# EasyEDA Pro project projet666.eprj, board PCB1
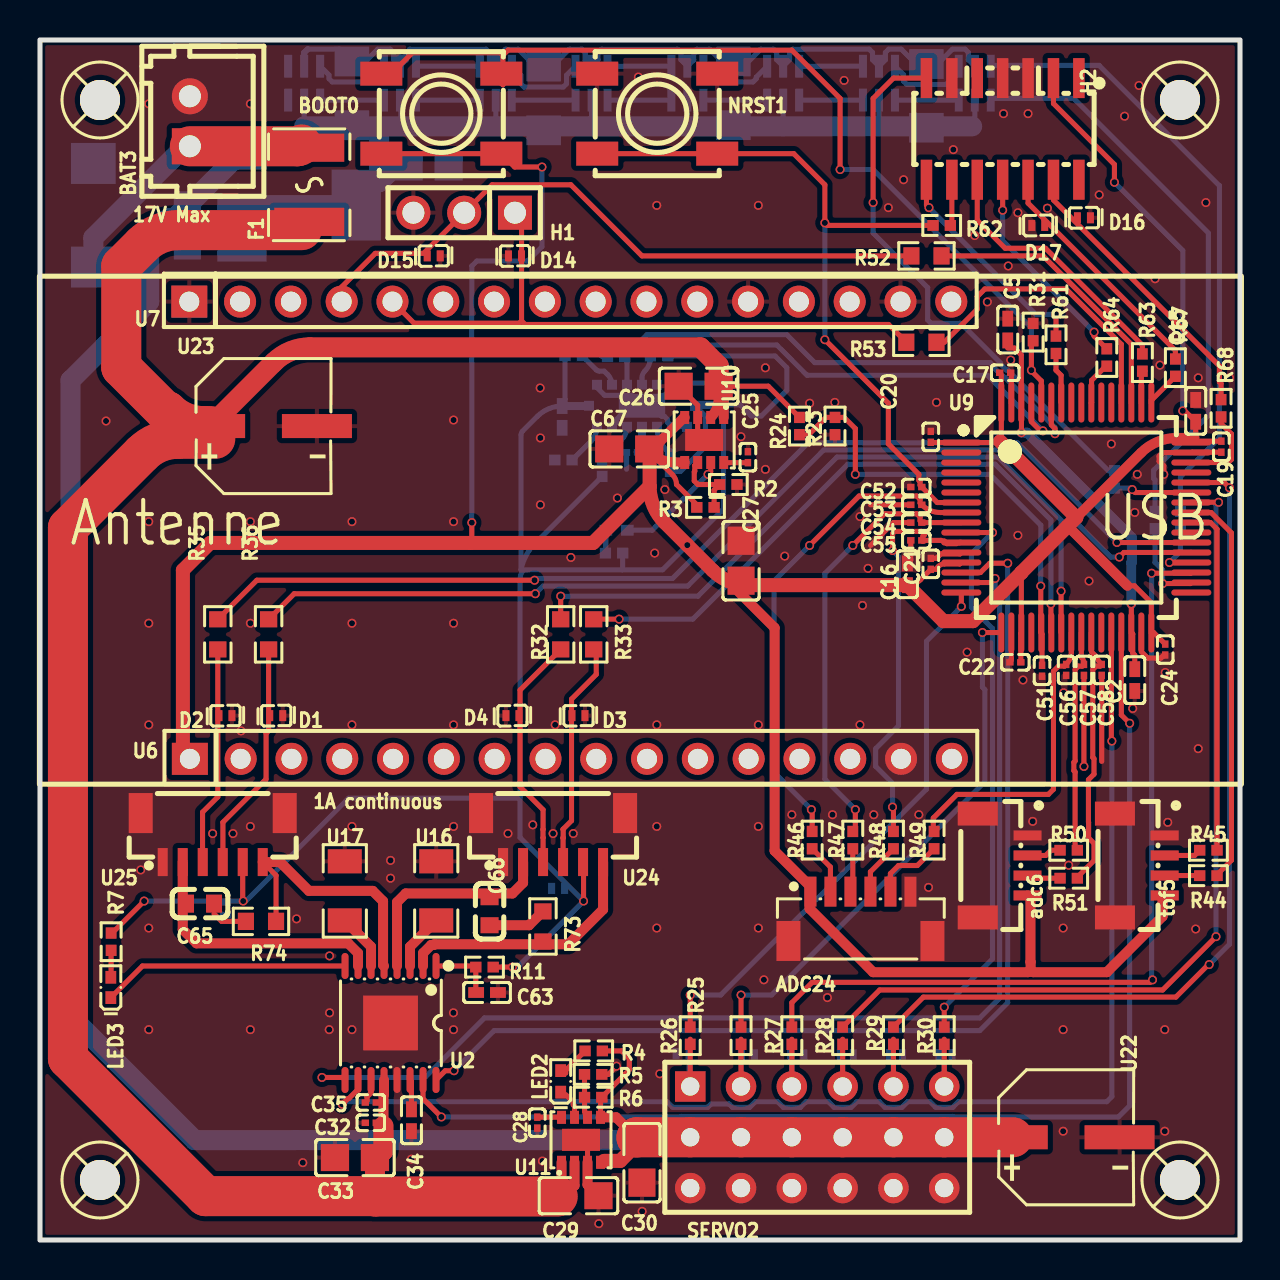
[diagram p9: board, top side]
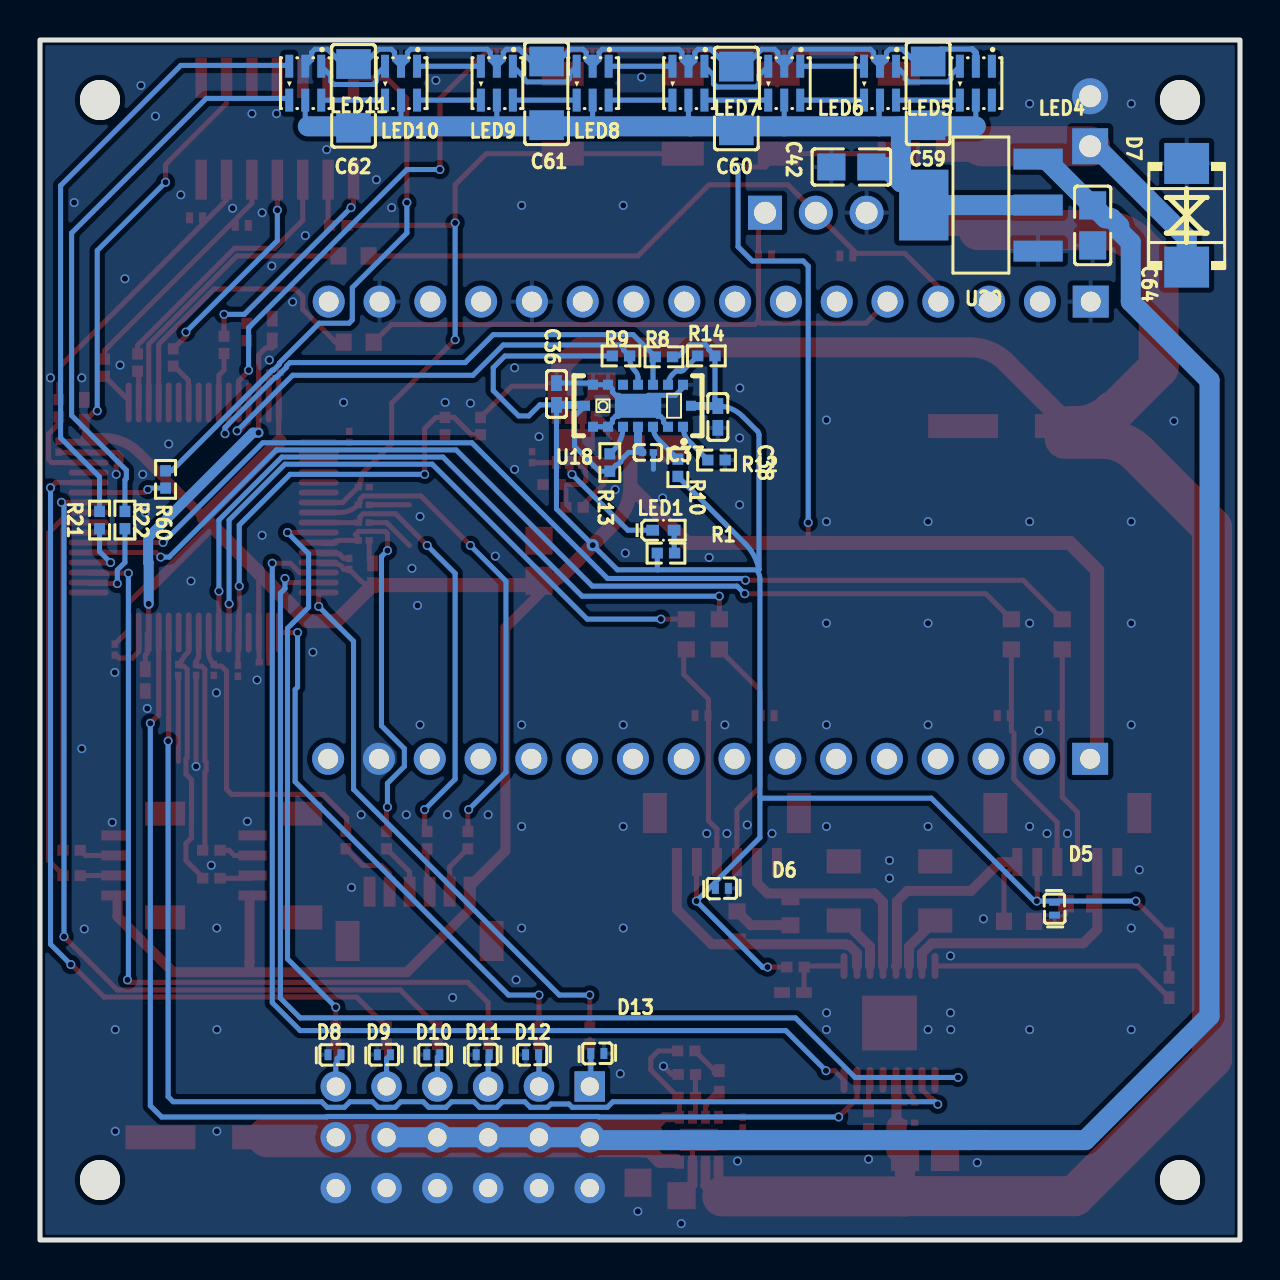
[diagram p10: board, bottom side, seen from below]

Outline 60 x 60 mm; copper layers: Top Layer, Bottom Layer. Coordinates in mm from the lower left corner of the outline.
Outline path: rectangle 0,60 60,0
Stack: Top Layer 0.035mm / Dielectric1 1.51mm FR4 er 4.5 / Bottom Layer 0.035mm

## Design rules (mm)
template: Custom Config
spacing copperThickness1oz (default): track to track 0.102, other pairs 0.152 to 0.3
spacing copperThickness2oz: track to track 0.203, other pairs 0.152 to 0.3
track width copperThickness1oz (default): min 0.127, default 0.254, max 2.54
track width copperThickness2oz: min 0.203, default 0.254, max 2.54
differential pair differentialPair (default): width min 0.127, default 0.254, max 2.54; gap min 0.152, default 0.152
via viaSize (default): diameter min 0.4, default 0.45, max 10; hole min 0.3, default 0.305, max 6.3

## Placement (name value [footprint] x y rotation side)
adc6  WAFER-SH1.0-4PLB  [CONN-SMD_4P-P1.00-C3029334]  48.13 18.72 270 top
ADC24  WAFER-SH1.0-6PLB  [CONN-SMD_6P-P1.00_1734595-6]  41.02 16.19 0 top
BAT3  ZX-XH2.54-2PZZ  [CONN-TH_2P-P2.50_HX25003-2A]  7.49 55.94 90 top
BOOT0  GT-TC063B-H035-L10  [SW-SMD_4P-L6.2-W6.2-P4.00-LS7.0]  20.07 56.32 180 top
C2  2.2uF  [C0402]  54.74 28 270 top
C5  2.2uF  [C0402]  48.39 45.52 90 top
C15  4.7uF  [C0402]  57.78 41.46 270 top
C16  1uF  [C0402]  43.37 33.29 270 top
C17  100nF  [C0201]  48.26 43.36 180 top
C19  100nF  [C0201]  59.07 39.67 90 top
C20  100nF  [C0201]  44.54 40.16 270 top
C21  100nF  [C0201]  44.54 33.81 270 top
C22  100nF  [C0201]  48.77 28.89 0 top
C24  100nF  [C0201]  56.26 29.52 90 top
C25  470pF  [C0201]  35.4 39.14 270 top
C26  22uF  [C0805]  32.93 42.69 0 top
C27  22uF  [C0805]  35.05 33.97 270 top
C28  470pF  [C0201]  24.87 5.87 90 top
C29  22uF  [C0805]  26.92 2.22 180 top
C30  22uF  [C0805]  30.1 3.87 90 top
C32  100nF  [C0201]  16.54 5.86 0 top
C33  10uF  [C0805]  15.75 4.12 0 top
C34  2.2uF  [C0402]  18.57 5.99 90 top
C35  10nF  [C0201]  16.54 6.88 180 top
C36  4.7uF  [C0402]  34.18 42.3 270 bottom
C37  100nF  [C0201]  29.6 39.38 0 bottom
C38  4.7uF  [C0402]  26.11 41.15 90 bottom
C42  22uF  [C0805]  19.43 53.65 180 bottom
C51  100nF  [C0201]  50.1 28.46 90 top
C52  100nF  [C0201]  43.81 37.65 0 top
C53  100nF  [C0201]  43.81 36.76 0 top
C54  100nF  [C0201]  43.81 35.87 0 top
C55  100nF  [C0201]  43.81 34.98 0 top
C56  100nF  [C0201]  51.31 28.5 90 top
C57  100nF  [C0201]  52.2 28.5 90 top
C58  100nF  [C0201]  53.09 28.5 90 top
C59  330nF  [C1206]  15.59 57.33 270 bottom
C60  330nF  [C1206]  25.18 57.08 270 bottom
C61  330nF  [C1206]  34.67 57.33 270 bottom
C62  330nF  [C1206]  44.32 57.21 270 bottom
C63  1uF  [C0402]  22.35 12.38 180 top
C64  22uF  [C0805]  7.37 50.73 90 bottom
C65  22nF  [C0603]  8 16.82 180 top
C66  22nF  [C0603]  22.48 16.44 90 top
C67  22uF  [C0805]  29.46 39.55 0 top
D1  RCLAMP0521P-N  [X1-DFN1006-2_L1.0-W0.6-P0.65-BI]  11.81 26.22 180 top
D2  RCLAMP0521P-N  [X1-DFN1006-2_L1.0-W0.6-P0.65-BI]  9.27 26.22 180 top
D3  RCLAMP0521P-N  [X1-DFN1006-2_L1.0-W0.6-P0.65-BI]  26.92 26.22 180 top
D4  RCLAMP0521P-N  [X1-DFN1006-2_L1.0-W0.6-P0.65-BI]  23.62 26.22 0 top
D5  RCLAMP0521P-N  [X1-DFN1006-2_L1.0-W0.6-P0.65-BI]  9.27 16.57 90 bottom
D6  RCLAMP0521P-N  [X1-DFN1006-2_L1.0-W0.6-P0.65-BI]  25.91 17.58 0 bottom
D7  SMBJ12CA  [SMB_L4.4-W3.6-LS5.3-BI]  2.67 51.24 270 bottom
D8  RCLAMP0521P-N  [X1-DFN1006-2_L1.0-W0.6-P0.65-BI]  45.27 9.26 180 bottom
D9  RCLAMP0521P-N  [X1-DFN1006-2_L1.0-W0.6-P0.65-BI]  42.81 9.26 180 bottom
D10  RCLAMP0521P-N  [X1-DFN1006-2_L1.0-W0.6-P0.65-BI]  40.34 9.26 180 bottom
D11  RCLAMP0521P-N  [X1-DFN1006-2_L1.0-W0.6-P0.65-BI]  37.87 9.26 180 bottom
D12  RCLAMP0521P-N  [X1-DFN1006-2_L1.0-W0.6-P0.65-BI]  35.4 9.26 180 bottom
D13  RCLAMP0521P-N  [X1-DFN1006-2_L1.0-W0.6-P0.65-BI]  32.13 9.33 0 bottom
D14  RCLAMP0521P-N  [X1-DFN1006-2_L1.0-W0.6-P0.65-BI]  23.75 49.2 0 top
D15  RCLAMP0521P-N  [X1-DFN1006-2_L1.0-W0.6-P0.65-BI]  19.69 49.2 180 top
D16  RCLAMP0521P-N  [X1-DFN1006-2_L1.0-W0.6-P0.65-BI]  52.2 51.11 180 top
D17  RCLAMP0521P-N  [X1-DFN1006-2_L1.0-W0.6-P0.65-BI]  49.91 50.73 0 top
F1  BSMD1812L-600-12V  [F1812]  13.46 52.76 90 top
H1  PZ254V-11-03P  [HDR-TH_3P-P2.54-V-M]  21.21 51.36 180 top
H2  FTSH-107-01-F-DV-K  [CONN-SMD_14P-P1.27_FTSH-107-01-F-DV-K-P-TR]  48.13 55.56 180 top
LED1  SZYY0402B  [LED0402-RD_BLUE]  28.83 35.49 180 bottom
LED2  SZYY0402B  [LED0402-RD_BLUE]  26.03 7.93 90 top
LED3  TZ-P2-0402RTIA1-0.45T  [LED0402-RD_RED]  3.54 12.63 90 top
LED4  SK9822-EC20  [LED-SMD_6P-L2.0-W2.0-P0.80-TL]  13.21 57.84 270 bottom
LED5  SK9822-EC20  [LED-SMD_6P-L2.0-W2.0-P0.80-TL]  18 57.84 270 bottom
LED6  SK9822-EC20  [LED-SMD_6P-L2.0-W2.0-P0.80-TL]  22.79 57.84 270 bottom
LED7  SK9822-EC20  [LED-SMD_6P-L2.0-W2.0-P0.80-TL]  27.58 57.84 270 bottom
LED8  SK9822-EC20  [LED-SMD_6P-L2.0-W2.0-P0.80-TL]  32.37 57.84 270 bottom
LED9  SK9822-EC20  [LED-SMD_6P-L2.0-W2.0-P0.80-TL]  37.16 57.84 270 bottom
LED10  SK9822-EC20  [LED-SMD_6P-L2.0-W2.0-P0.80-TL]  41.95 57.84 270 bottom
LED11  SK9822-EC20  [LED-SMD_6P-L2.0-W2.0-P0.80-TL]  46.74 57.84 270 bottom
NRST1  GT-TC063B-H035-L10  [SW-SMD_4P-L6.2-W6.2-P4.00-LS7.0]  30.86 56.32 180 top
R1  10kΩ  [R0402]  28.7 34.35 0 bottom
R2  100kΩ  [R0402]  34.42 37.78 180 top
R3  309kΩ  [R0402]  33.27 36.63 180 top
R4  10kΩ  [R0402]  27.69 9.45 0 top
R5  100kΩ  [R0402]  27.66 8.28 180 top
R6  649kΩ  [R0402]  27.66 7.14 0 top
R7  3.3kΩ  [R0402]  3.56 14.92 90 top
R8  2.2kΩ  [R0402]  28.81 44.16 180 bottom
R9  2.2kΩ  [R0402]  30.95 44.2 0 bottom
R10  47kΩ  [R0402]  28.11 38.61 270 bottom
R11  47kΩ  [R0402]  22.22 13.64 0 top
R12  47kΩ  [R0402]  26.18 39 0 bottom
R13  47kΩ  [R0402]  31.51 38.87 270 bottom
R14  47kΩ  [R0402]  26.68 44.21 180 bottom
R21  100Ω  [R0402]  57.02 36 90 bottom
R22  100Ω  [R0402]  55.75 36 90 bottom
R23  10kΩ  [R0402]  39.75 40.7 90 top
R24  30kΩ  [R0402]  37.97 40.7 90 top
R25  470Ω  [R0402]  32.51 10.22 270 top
R26  470Ω  [R0402]  35.05 10.22 270 top
R27  470Ω  [R0402]  37.59 10.22 270 top
R28  470Ω  [R0402]  40.13 10.22 270 top
R29  470Ω  [R0402]  42.67 10.22 270 top
R30  470Ω  [R0402]  45.21 10.22 270 top
R31  10kΩ  [R0402]  49.66 45.39 90 top
R32  220Ω  [R0603]  26.03 30.28 90 top
R33  220Ω  [R0603]  27.69 30.28 90 top
R35  220Ω  [R0603]  8.89 30.28 270 top
R36  220Ω  [R0603]  11.43 30.28 270 top
R44  22Ω  [R0402]  58.42 18.22 180 top
R45  22Ω  [R0402]  58.42 19.49 180 top
R46  15kΩ  [R0402]  38.61 20 270 top
R47  15kΩ  [R0402]  40.64 20 270 top
R48  15kΩ  [R0402]  42.67 20 270 top
R49  15kΩ  [R0402]  44.7 20 270 top
R50  15kΩ  [R0402]  51.44 19.49 180 top
R51  15kΩ  [R0402]  51.44 18.09 180 top
R52  220Ω  [R0603]  44.32 49.2 0 top
R53  220Ω  [R0603]  44.07 44.89 0 top
R60  33Ω  [R0402]  53.72 38.03 270 bottom
R61  33Ω  [R0402]  50.8 44.76 90 top
R62  33Ω  [R0402]  45.09 50.73 0 top
R63  33Ω  [R0402]  55.12 43.87 90 top
R64  33Ω  [R0402]  53.34 44.12 90 top
R67  33Ω  [R0402]  56.77 43.62 90 top
R68  33Ω  [R0402]  59.06 41.58 90 top
R73  4.7Ω  [R0603]  25.15 15.68 90 top
R74  4.7Ω  [R0603]  11.05 15.93 180 top
SCREW1  -  [Screw-Hole-M2]  3 57 0 top
SCREW2  -  [Screw-Hole-M2]  57 57 0 top
SCREW3  -  [Screw-Hole-M2]  57 3 0 top
SCREW4  -  [Screw-Hole-M2]  3 3 0 top
SERVO2  HX PZ2.54-3x6P ZZ  [CONN-TH_HX-PZ2.54-3X6P-ZZ]  38.86 5.14 0 top
tof5  WAFER-SH1.0-4PLB  [CONN-SMD_4P-P1.00-C3029334]  54.99 18.72 270 top
U2  DRV8833PWPR  [TSSOP-16_L5.0-W4.4-P0.65-LS6.4-BL-EP]  17.53 10.85 180 top
U6  PM254-1-16-Z-8.5  [HDR-TH_16P-P2.54-V-F-A]  26.54 24.06 0 top
U7  PM254-1-16-Z-8.5  [HDR-TH_16P-P2.54-V-F-A]  26.51 46.92 0 top
U9  STM32H563RIT6  [LQFP-64_L10.0-W10.0-P0.50-LS12.0-BL]  51.82 36.12 270 top
U10  TPS82130SILR  [USIP-8_L3.0-W2.8-P0.65-TL-EP]  33.21 40 270 top
U11  TPS82130SILR  [USIP-8_L3.0-W2.8-P0.65-TL-EP]  27.05 5.01 90 top
U16  130mΩ  [R1206]  19.81 17.45 270 top
U17  130mΩ  [R1206]  15.24 17.45 270 top
U18  VL53L7CXV0GC/1  [LGA-16_L6.4-W3.0_VL53L5CXV0GC-1]  30.1 41.71 180 bottom
U20  AMS1117-5.0  [SOT-223_L6.5-W3.5-P2.30-LS7.0-BR]  12.95 51.75 180 bottom
U22  330uF  [CAP-SMD_BD6.3-L6.6-W6.6-LS7.4-FD]  51.31 5.14 0 top
U23  330uF  [CAP-SMD_BD6.3-L6.6-W6.6-LS7.4-FD]  11.18 40.7 0 top
U24  ZX-SH1.0-6PLT  [CONN-SMD_6P-P1.00_ZX-SH1.0-6PLT]  25.65 20.12 180 top
U25  ZX-SH1.0-6PLT  [CONN-SMD_6P-P1.00_ZX-SH1.0-6PLT]  8.64 20.12 180 top

## Footprints (pads in the part's own frame, mm; a bottom-side part is the same pattern mirrored in y, then rotated)
C0201
  rect 0.368x0.324 smd: 1(-0.275,0) 2(0.275,0)
C0402
  rect 0.79x0.54 smd: 1(-0.545,0) 2(0.545,0)
C0603
  rect 0.8x0.9 smd: 1(-0.7,0) 2(0.7,0)
C0805
  rect 1.41x1.35 smd: 1(-1,0) 2(1,0)
C1206
  rect 1.485x1.728 smd: 1(-1.593,0) 2(1.593,0)
CAP-SMD_BD6.3-L6.6-W6.6-LS7.4-FD
  rect 3.5x1.2 smd: 1(-2.67,0) 2(2.67,0)
CONN-SMD_4P-P1.00-C3029334
  rect 0.5x1.4 smd: 1(-1.502,1.244) 2(-0.501,1.244) 3(0.501,1.242) 4(1.499,1.244)
  rect 1.2x2 smd: 5(-2.595,-1.244) 6(2.595,-1.244)
CONN-SMD_6P-P1.00_1734595-6
  rect 0.6x1.5 smd: 1(-2.5,1.232) 2(-1.5,1.232) 3(-0.5,1.232) 4(0.5,1.232) 5(1.5,1.232) 6(2.5,1.232)
  rect 1.2x2 smd: 7(-3.6,-1.232) 8(3.6,-1.232)
CONN-SMD_6P-P1.00_ZX-SH1.0-6PLT
  rect 0.5x1.4 smd: 1(2.5,1.225) 2(1.5,1.225) 3(0.5,1.225) 4(-0.5,1.225) 5(-1.5,1.225) 6(-2.5,1.225)
  rect 1.2x2 smd: 7(-3.6,-1.225) 8(3.6,-1.225)
CONN-SMD_14P-P1.27_FTSH-107-01-F-DV-K-P-TR
  rect 0.574x2 smd: 1(-3.81,-2.54) 2(-3.81,2.54) 3(-2.54,-2.54) 4(-2.54,2.54) 5(-1.27,-2.54) 6(-1.27,2.54) 7(0,-2.54) 8(0,2.54) 9(1.27,-2.54) 10(1.27,2.54) 11(2.54,-2.54) 12(2.54,2.54) 13(3.81,-2.54) 14(3.81,2.54)
CONN-TH_2P-P2.50_HX25003-2A
  rect 1.8x1.8 hole 1.1: 1(-1.25,0)
  round 1.8 hole 1.1: 2(1.25,0)
CONN-TH_HX-PZ2.54-3X6P-ZZ
  rect 1.524x1.524 hole 0.914: 1(-6.35,2.54)
  round 1.524 hole 0.914: 2(-3.81,2.54) 3(-1.27,2.54) 4(1.27,2.54) 5(3.81,2.54) 6(6.35,2.54) 7(-6.35,0) 8(-3.81,0) 9(-1.27,0) 10(1.27,0) 11(3.81,0) 12(6.35,0) 13(-6.35,-2.54) 14(-3.81,-2.54) 15(-1.27,-2.54) 16(1.27,-2.54) 17(3.81,-2.54) 18(6.35,-2.54)
F1812
  rect 1.407x3.499 smd: 1(-1.853,0) 2(1.853,0)
HDR-TH_3P-P2.54-V-M
  rect 1.7x1.7 hole 1.1: 1(-2.54,0)
  round 1.7 hole 1.1: 2(0,0) 3(2.54,0)
HDR-TH_16P-P2.54-V-F-A
  rect 1.8x1.6 hole 1: 1(-19.05,0)
  round 1.6 hole 1: 2(-16.51,0) 3(-13.97,0) 4(-11.43,0) 5(-8.89,0) 6(-6.35,0) 7(-3.81,0) 8(-1.27,0) 9(1.27,0) 10(3.81,0) 11(6.35,0) 12(8.89,0) 13(11.43,0) 14(13.97,0) 15(16.51,0) 16(19.05,0)
LED0402-RD_BLUE
  rect 0.636x0.54 smd: 1(-0.538,0) 2(0.538,0)
LED0402-RD_RED
  rect 0.636x0.54 smd: 1(-0.508,0) 2(0.508,0)
LED-SMD_6P-L2.0-W2.0-P0.80-TL
  rect 1.145x0.4 smd: 1(-0.848,0.8) 2(-0.848,0) 3(-0.848,-0.8) 4(0.848,-0.8) 5(0.848,0) 6(0.848,0.8)
LGA-16_L6.4-W3.0_VL53L5CXV0GC-1
  rect 0.5x0.5 smd: A1(2.25,-1.05) A2(1.5,-1.05) A3(0.75,-1.05) A4(0,-1.05) A5(-0.75,-1.05) A6(-1.5,-1.05) A7(-2.25,-1.05) B1(2.65,0) B7(-2.65,0) C1(2.25,1.05) C2(1.5,1.05) C3(0.75,1.05) C4(0,1.05) C5(-0.75,1.05) C6(-1.5,1.05) C7(-2.25,1.05)
  rect 2.316x1.2 smd: B4(0,0)
LQFP-64_L10.0-W10.0-P0.50-LS12.0-BL
  oval 0.3x2 smd: 1(-3.75,-5.75) 2(-3.25,-5.75) 3(-2.75,-5.75) 4(-2.25,-5.75) 5(-1.75,-5.75) 6(-1.25,-5.75) 7(-0.75,-5.75) 8(-0.25,-5.75) 9(0.25,-5.75) 10(0.75,-5.75) 11(1.25,-5.75) 12(1.75,-5.75) 13(2.25,-5.75) 14(2.75,-5.75) 15(3.25,-5.75) 16(3.75,-5.75) 33(3.75,5.75) 34(3.25,5.75) 35(2.75,5.75) 36(2.25,5.75) 37(1.75,5.75) 38(1.25,5.75) 39(0.75,5.75) 40(0.25,5.75) 41(-0.25,5.75) 42(-0.75,5.75) 43(-1.25,5.75) 44(-1.75,5.75) 45(-2.25,5.75) 46(-2.75,5.75) 47(-3.25,5.75) 48(-3.75,5.75)
  oval 2x0.3 smd: 17(5.75,-3.75) 18(5.75,-3.25) 19(5.75,-2.75) 20(5.75,-2.25) 21(5.75,-1.75) 22(5.75,-1.25) 23(5.75,-0.75) 24(5.75,-0.25) 25(5.75,0.25) 26(5.75,0.75) 27(5.75,1.25) 28(5.75,1.75) 29(5.75,2.25) 30(5.75,2.75) 31(5.75,3.25) 32(5.75,3.75) 49(-5.75,3.75) 50(-5.75,3.25) 51(-5.75,2.75) 52(-5.75,2.25) 53(-5.75,1.75) 54(-5.75,1.25) 55(-5.75,0.75) 56(-5.75,0.25) 57(-5.75,-0.25) 58(-5.75,-0.75) 59(-5.75,-1.25) 60(-5.75,-1.75) 61(-5.75,-2.25) 62(-5.75,-2.75) 63(-5.75,-3.25) 64(-5.75,-3.75)
R0402
  rect 0.566x0.54 smd: 1(-0.433,0) 2(0.433,0)
R0603
  rect 0.806x0.864 smd: 1(-0.753,0) 2(0.753,0)
R1206
  rect 1.208x1.701 smd: 1(-1.479,0) 2(1.479,0)
Screw-Hole-M2
  round 2 hole 2: 1(0,0)
SMB_L4.4-W3.6-LS5.3-BI
  rect 2.047x2.241 smd: 1(-2.591,0) 2(2.591,0)
SOT-223_L6.5-W3.5-P2.30-LS7.0-BR
  rect 2.465x1.05 smd: 1(2.857,-2.3) 2(2.857,0) 3(2.857,2.3)
  rect 2.465x3.54 smd: 4(-2.857,0)
SW-SMD_4P-L6.2-W6.2-P4.00-LS7.0
  rect 2.1x1.2 smd: 1(-3,2) 2(3,2) 3(-3,-2) 4(3,-2)
TSSOP-16_L5.0-W4.4-P0.65-LS6.4-BL-EP
  oval 0.35x1.3 smd: 1(-2.275,-2.85) 2(-1.625,-2.85) 3(-0.975,-2.85) 4(-0.325,-2.85) 5(0.325,-2.85) 6(0.975,-2.85) 7(1.625,-2.85) 8(2.275,-2.85) 9(2.275,2.85) 10(1.625,2.85) 11(0.975,2.85) 12(0.325,2.85) 13(-0.325,2.85) 14(-0.975,2.85) 15(-1.625,2.85) 16(-2.275,2.85)
  rect 2.74x2.74 smd: 17(0,0)
USIP-8_L3.0-W2.8-P0.65-TL-EP
  rect 0.65x0.45 smd: 1(-1.125,0.975) 2(-1.125,0.325) 3(-1.125,-0.325) 4(-1.125,-0.975) 5(1.125,-0.975) 6(1.125,-0.325) 7(1.125,0.325) 8(1.125,0.975)
  rect 1.1x1.9 smd: 9(0,0)
X1-DFN1006-2_L1.0-W0.6-P0.65-BI
  rect 0.35x0.55 smd: 1(-0.325,0) 2(0.325,0)

## Nets
As in the schematic.

Pads without a net: H2 1 2 9; LED4 1 6; SCREW1 1; SCREW2 1; SCREW3 1; SCREW4 1; U6 2 3 4 5 6 7 8 9 10 11 12 13 14 16; U7 2 3 6 7 8 9 10 11 13 14 16; U9 2 3 4 5 6 20 27 33 39 45 53 54 57; U18 C5

## Via types
v1: diameter 0.45, hole 0.305, Top Layer to Bottom Layer, 183 vias
v2: diameter 0.61, hole 0.305, Top Layer to Bottom Layer, 1 via

## Routing (per net, layer and track width the routed paths; a pad name or vN(x,y) marks a point on that pad's centre or on a via; arc(x,y) is an arc through that point)
+3.3V: length 313.8
  Top Layer w0.254: v1(23.62,13.64) R11.2 ; v1(57.14,41.46) 57.24,41.46 C15.2 57.78,40.4 arc(57.77,40.25) 57.72,40.1 arc(57.65,39.98) U9.48 arc(57.64,39.92) 57.72,39.94 C19.2 ; v1(21.59,35.87) 21.59,34.94 21.51,34.85 ; 49.07,33.36 U9.19 arc(49.05,30.35) 49.04,30.32 C22.2 ; 30.48,39.41 31.62,38.27 arc(31.77,38.04) 31.82,37.78 32.84,36.76 R3.2 ; v1(27.18,16.95) 27.18,18.87 U24.5 ; R7.2 3.61,15.35 v1(5.21,16.95) ; U25.5 10.14,16.97 v1(10.16,16.95) ; v1(53.72,52.89) 53.72,53.78 50.67,56.83 H2.3 ; v1(25.1,53.65) 23.73,53.65 BOOT0.1 BOOT0.2 ; C20.2 44.55,39.87 U9.1 47.95,39.87 48.07,39.99 U9.64 48.07,43.25 ; C24.2 55.68,30.37 U9.32 55.57,31.87 54.72,32.71 54.37,32.71 ; 49.07,33.36 arc(49.07,33.37) 49.07,33.38 ; C16.2 arc(43.72,32.81) 44.01,33.01 44.54,33.53 44.82,33.53 arc(44.98,33.73) 45.22,33.8 45.99,33.8 arc(46.03,33.84) U9.13
  Top Layer w0.5: 34.37,32.97 36.73,30.61 36.73,19.46 38.48,17.71 38.48,16.57 41.66,13.39 49.4,13.39 49.53,13.52 ; adc6.4 49.52,17.08 49.52,13.91 49.53,13.9 49.53,13.52 ; 51.82,36.12 55.05,39.36 arc(55.88,39.91) 56.85,40.1 57.72,40.1 ; 49.53,13.52 49.66,13.39 53.34,13.39 56.13,16.18 56.13,17.12 tof5.4 ; U10.5 31.76,38.88 arc(31.07,39.01) 30.48,39.41 32.18,41.1 arc(32.2,41.12) U10.4 ; 54.37,32.71 51.39,35.7
  Top Layer w0.7: 48.01,39.93 51.82,36.12 49.07,33.38 49.07,33.37 46.65,30.94 45.17,30.94 C16.2 35.42,32.74 arc(34.88,32.8) 34.37,32.97 arc(33.97,33.2) 33.63,33.49 31.22,35.89 arc(30.67,36.71) 30.48,37.68 ; 30.48,39.41 30.48,37.68 ; 30.48,37.68 27.65,34.85 8.51,34.85 7.14,33.49 7.14,24.41 7.49,24.06
  Bottom Layer w0.254: R9.2 36.75,44.2 37.34,43.62 37.34,42.47 36.07,41.2 35.56,41.2 35.01,41.76 C36.2 34.18,36.56 v2(32.36,34.74) 31.13,33.51 29.11,33.51 ; v1(53.72,52.89) 57.14,49.47 v1(57.14,41.46) ; C37.2 30.57,39.38 30.96,38.99 30.96,38.91 31.12,38.74 31.21,38.74 R13.2 32.03,38.44 33.27,39.68 33.27,41.19 U18.B7 arc(32.8,41.74) 32.85,41.76 ; 24.05,33.51 24.05,40.25 arc(24.07,40.35) 24.13,40.44 24.87,41.19 arc(25.44,41.56) C38.2 arc(26.21,41.85) 26.25,42.04 R14.2 26.55,44.51 26.55,44.59 26.72,44.75 27.51,44.75 28.06,44.21 28.33,44.21 R8.2 ; 24.05,33.51 29.11,33.51 ; 24.05,33.51 arc(24.3,34.22) 24.75,34.82 28.11,38.18 ; 29.11,33.51 29.13,33.53 R1.2 ; v1(25.1,53.65) 25.1,49.67 24.38,48.95 21.84,48.95 21.59,48.7 v1(21.59,35.87) ; 24,22.16 23.94,22.09 15.43,22.09 10.29,16.95 v1(10.16,16.95) v1(5.21,16.95) ; 24,22.16 24,33.02 arc(24.04,33.25) 24.13,33.46 ; 24,22.16 24,20.12 v1(27.18,16.95) 23.88,13.64 v1(23.62,13.64)
  Bottom Layer w0.4: C38.2 27.41,41.7 arc(27.43,41.7) U18.B1 ; C36.2 32.85,41.76 ; U18.A4 30.1,39.91 arc(30.04,39.62) C37.2
+5.0V: length 54.7
  Bottom Layer w0.254: LED7.5 27.58,55.94 arc(27.55,55.8) 27.47,55.68 ; LED8.5 32.37,55.68 ; LED6.5 22.79,55.68 ; LED10.5 41.95,55.74 arc(41.94,55.71) 41.93,55.68 ; 18.04,55.68 18.04,56.88 arc(18.03,56.94) LED5.5 ; LED11.5 46.74,55.99 arc(46.7,55.82) 46.61,55.68 ; LED9.5 37.16,55.68 ; U20.4 16.95,52.89 ; LED4.5 13.21,55.68
  Bottom Layer w1: 46.61,55.68 16.95,55.68 ; C42.2 17.72,53.65 16.95,52.89 16.95,55.68 ; 16.95,55.68 13.21,55.68 ; U20.4 11.24,51.75
+6.0V: length 118.7
  Top Layer w0.254: R4.2 29.08,9.45 29.46,9.07 29.46,8.51 R6.2 arc(28.04,7.07) 28.03,6.98 U11.5
  Top Layer w0.5: U11.5 28.81,6.13 29.82,5.12
  Top Layer w0.7: 28.2,3.96 29.01,3.96 29.56,4.51 arc(29.75,4.79) 29.82,5.12
  Top Layer w2: 29.82,5.12 29.83,5.14 SERVO2.7 SERVO2.8 SERVO2.9 SERVO2.10 SERVO2.11 SERVO2.12 U22.1
  Bottom Layer w1: SERVO2.11 SERVO2.10 SERVO2.9 SERVO2.8 SERVO2.7 32.37,5 13.5,5 13.5,5 12.78,5 12.77,5 7.73,5 1.52,11.2 1.52,42.98 5.46,46.92 5.46,49.88 6.04,50.46 6.04,50.7 6.42,51.09 6.72,51.09 C64.2 ; U20.3 9.72,54.05 7.54,51.87
GND: length 89.7
  Top Layer w0.254: U11.3 27.38,4.68 U11.9 ; C55.1 43.54,34 C16.1 ; C19.1 57.61,39.39 arc(57.58,39.39) U9.47 56.13,39.37 55.95,39.19 55.95,38.94 56.19,38.71 v1(56.19,38.28) ; 41.53,34.73 42.67,35.87 C54.1 ; C57.1 v1(52.2,23.68) ; R5.1 28.42,8.28 v1(28.83,8.69) ; C26.1 32.88,41.74 U10.3 32.88,40.33 33.21,40 ; C24.1 56.19,29.25 56.04,29.09 55.39,29.09 55.07,29.42 U9.31 ; C53.1 41.53,36.76 ; U9.18 48.57,29.06 arc(48.55,28.97) C22.1 ; U9.12 46,34.3 45.04,34.3 44.82,34.08 C21.1 ; C58.1 53.09,23.93 ; U9.63 48.57,43.29
  Top Layer w0.5: U11.3 27.38,2.76 C29.1
  Bottom Layer w0.254: U18.B4 29.65,41.71 29.13,41.19 28.98,41.19 28.82,41.03 28.82,40.88 U18.A2 ; U18.B4 30.55,41.71 ; U18.B4 29.58,42.23 28.23,42.23 27.85,42.62 U18.C1 ; C37.1 29.33,38.54 ; 30.55,41.71 31.07,41.19 31.21,41.19 31.38,41.03 31.38,40.88 U18.A6 U18.A7 ; 30.55,41.71 31.07,42.23 31.21,42.23 31.38,42.4 31.38,42.54 U18.C6 U18.C7 32.43,42.85 C36.1 ; 13.39,59.54 14.97,59.54 C59.1 16.27,58.92 16.88,59.54 17.51,59.54 17.68,59.38 17.68,59.01 LED5.2 18.32,59.01 18.32,59.38 18.48,59.54 22.3,59.54 22.47,59.38 22.47,59.01 LED6.2 23.11,59.01 23.11,59.38 23.27,59.54 23.9,59.54 24.75,58.69 25.16,58.69 C60.1 25.59,58.67 26.46,59.54 27.09,59.54 27.26,59.38 27.26,58.97 27.54,58.69 LED7.2 27.9,59.01 27.9,59.38 28.06,59.54 31.88,59.54 32.05,59.38 32.05,59.01 LED8.2 32.69,59.01 32.69,59.38 32.85,59.54 33.48,59.54 34.1,58.93 C61.1 35.43,58.93 36.04,59.54 36.67,59.54 36.84,59.38 36.84,59.01 LED9.2 37.48,59.01 37.48,59.38 37.64,59.54 41.46,59.54 41.63,59.38 41.63,59.01 LED10.2 42.27,59.01 42.27,59.38 42.43,59.54 43.06,59.54 43.91,58.69 44.21,58.69 C62.1 44.88,58.8 45.62,59.54 46.25,59.54 46.42,59.38 46.42,59.01 LED11.2
  Bottom Layer w0.305: 13.39,59.54 13.21,59.36 LED4.2
  vias: v1(3.3,40.95) v1(5.04,18.5) v1(5.44,56.81) v1(5.44,35.92) v1(5.44,30.84) v1(5.44,25.76) v1(5.44,15.6) v1(5.44,10.52) v1(8.63,20.32) v1(9.65,20.32) v1(10.05,25.46) v1(10.52,56.81) v1(10.52,35.92) v1(10.52,30.84) v1(10.52,20.68) v1(10.52,10.52) v1(12.83,16.06) v1(13.14,3.87) v1(14.48,14.2) v1(14.48,11.36) v1(14.46,10.52) v1(15.6,35.92) v1(15.6,30.84) v1(15.6,25.76) v1(15.6,20.68) v1(15.6,10.52) v1(17.53,18.98) v1(17.53,18.09) v1(18.57,4.04) v1(20.68,41) v1(20.68,35.92) v1(20.68,30.84) v1(20.68,25.76) v1(20.68,20.68) v1(20.67,11.36) v1(20.68,10.52) v1(23.4,20.32) v1(24.64,20.76) v1(25.01,42.6) v1(25.02,40.1) v1(25.02,36.76) v1(25.12,3.95) v1(25.65,20.32) v1(25.76,25.76) v1(26.54,34.13) v1(26.66,20.32) v1(27.94,0.82) v1(28.87,37.1) v1(29.92,58.15) v1(30.11,1.43) v1(30.73,34.35) v1(30.84,51.73) v1(30.84,25.76) v1(30.84,20.68) v1(30.84,15.6) v1(30.99,8.31) v1(31.24,37.52) v1(35.05,40.17) v1(35.92,51.73) v1(35.92,25.76) v1(35.92,20.68) v1(35.92,15.6) v1(36.19,13.01) v1(36.27,43.61) v1(36.27,38.53) v1(37.24,34.19) v1(37.59,21.27) v1(38.48,41.84) v1(39.37,12.12) v1(39.62,21.27) v1(39.74,41.88) v1(40.21,57.98) v1(41,36.17) v1(41,25.76) v1(41.12,31.73) v1(41.4,33.58) v1(41.69,21.27) v1(42.42,51.62) v1(43.18,53.02) v1(43.94,21.27) v1(44.43,17.63) v1(44.82,41.88) v1(45.67,54.52) v1(46.35,29.39) v1(46.74,50.22) v1(47.37,46.9) v1(48.18,56.32) v1(48.41,48.7) v1(48.53,44) v1(48.9,51.36) v1(48.9,35.23) v1(49.15,28) v1(49.4,56.32) v1(49.63,20.93) v1(50.37,51.59) v1(51.18,27.36) v1(51.16,15.6) v1(51.16,10.52) v1(51.16,5.44) v1(51.44,18.74) v1(52.45,32.95) v1(52.96,52.26) v1(53.57,39.8) v1(54.23,56.19) v1(54.64,26.58) v1(54.74,36.38) v1(54.86,38.28) v1(54.95,57.73) v1(55.75,48.06) v1(56,43.74) v1(56.24,10.52) v1(56.24,5.44) v1(56.26,28.38) v1(56.39,20.88) v1(57.78,15.55) v1(57.91,43.11) v1(57.91,24.57) v1(58.29,51.87) v1(59.47,43.11)
VBAT_VSENS: length 23
  Top Layer w0.254: v1(50.04,32.69) 50.04,30.4 U9.21 arc(50.09,30.33) 50.1,30.29 C51.2 ; v1(40.77,38.28) 40.77,40.57 40.21,41.13 R23.2 39.29,41.13 38.43,40.26 37.97,40.26
  Bottom Layer w0.254: v1(50.04,32.69) 50.04,35.74 47.5,38.28 v1(40.77,38.28)
VIN: length 127.6
  Top Layer w0.254: R24.2 36.41,42.69 C26.2
  Top Layer w0.5: U10.1 34.18,42.08 ; U11.2 26.73,2.72 26.33,2.72 26.08,2.98 U11.1 ; 17.18,5.7 17.18,7.26 17.2,7.29 17.2,8 ; U10.2 arc(33.83,41.57) 33.93,42.09
  Top Layer w1: 16.75,1.83 C33.2 16.82,4.12 17.18,4.47 17.18,5.7 ; U23.1 11.7,43.89 arc(12.52,44.44) 13.5,44.63 33.02,44.63 33.93,43.72 C26.2
  Top Layer w2: 13.08,50.49 6.91,50.49 arc(5.94,50.3) 5.12,49.75 4.06,48.7 4.06,43.63 6.25,41.44 6.37,41.44 arc(7.19,40.89) 8.16,40.7 U23.1 ; 25.89,2.18 16.76,2.18 16.75,2.19 8.28,2.19 1.4,9.07 1.4,35.62 5.1,39.32 arc(5.92,39.87) 6.89,40.06 8.76,40.06
ADC4: length 15.6
  Top Layer w0.254: U9.24 51.57,29.4 arc(51.5,29.06) C56.2 51.22,28.69 50.93,28.69 50.67,28.44 50.67,22.53 50.42,22.28 45.85,22.28 44.67,21.1 44.67,20.47 R49.1
ADC8: length 11.3
  Top Layer w0.254: R50.1 51.76,19.6 51.76,23.41 51.69,23.47 51.69,23.89 51.76,23.95 51.76,28.53 51.92,28.69 52.11,28.69 C57.2 52.2,28.83 arc(52.16,29) 52.07,29.14 arc(52.07,29.14) 52.07,29.15 U9.25
ADC9: length 13.2
  Top Layer w0.254: U9.26 52.57,29.44 arc(52.57,29.42) 52.58,29.4 52.76,29.22 arc(52.91,28.99) C58.2 53,28.69 52.81,28.69 52.64,28.52 52.64,24.13 52.7,24.06 52.7,23.29 52.42,23.01 52.42,20.9 52.43,20.89 52.43,20.1 52.7,19.83 52.7,18.97 51.93,18.21 51.91,18.21
ADC10: length 24.8
  Top Layer w0.254: v1(38.57,21.52) 38.61,21.48 R46.1 ; v1(38.48,34.73) 40.95,37.2 43.84,37.2 44,37.04 44,36.84 C53.2 arc(44.52,36.47) 45.02,36.37 U9.8
  Bottom Layer w0.254: v1(38.48,34.73) 36.7,32.95 36.7,23.39 v1(38.57,21.52)
ADC11: length 21.9
  Top Layer w0.254: R47.1 40.77,20.56 v1(40.77,21.52) ; v1(40.64,34.73) 42.22,36.31 43.84,36.31 44,36.15 44,35.96 C54.2 46.06,35.87 arc(46.06,35.87) U9.9
  Bottom Layer w0.254: v1(40.77,21.52) 39.24,23.04 39.24,33.33 v1(40.64,34.73)
ADC13: length 19.8
  Top Layer w0.254: v1(42.63,21.65) 42.67,21.6 R48.1 ; 45.84,34.82 45.34,34.82 45.22,34.94 arc(45.13,34.95) 45.04,34.98 44.14,34.98 ; v1(42.63,34.47) 42.63,35.32 42.73,35.43 44.07,35.43 44.23,35.27 44.14,35.18 44.14,34.98 ; 44.14,34.98 44.14,34.93 ; U9.11 arc(46.01,34.89) 45.97,34.85
  Bottom Layer w0.254: v1(42.63,34.47) 42.93,34.17 42.93,25.71 41.78,24.57 41.78,23.68 42.63,22.83 v1(42.63,21.65)
BOOT0: length 48
  Top Layer w0.254: 23.15,59.24 23.4,59.49 37.59,59.49 40,57.08 v1(40,53.52) ; 23.15,59.24 23.02,59.36 18.62,59.36 17.27,58.02 17.27,57.89 ; 23.15,59.24 23.15,57.76 23.07,57.84 ; R31.1 49.57,44.88 v1(49.57,43.49) 49.57,43.45 50.07,42.95 U9.60
  Bottom Layer w0.254: v1(40,53.52) 41.66,53.52 49.57,45.61 v1(49.57,43.49)
ENCODER1_1: length 11.4
  Top Layer w0.254: R33.1 27.81,29.4 27.81,28.28 26.58,27.05 26.58,20.97 26.15,20.54 26.16,20.53 26.16,20.11 26.15,20.11 26.15,20.1 U24.4
ENCODER1_2: length 12
  Top Layer w0.254: R32.1 24,27.5 24,22.66 25.15,21.51 25.15,20.54 25.15,20.53 25.15,20.11 25.15,20.11 U24.3
ENCODER2_1: length 11.6
  Top Layer w0.254: R36.2 11.43,25.46 11.3,25.33 11.3,23.04 9.14,20.88 9.14,18.91 U25.4
ENCODER2_2: length 11
  Top Layer w0.254: U25.3 8.13,18.91 8.13,21.39 8.89,22.15 R35.2
JTCK_SWCLK: length 1.8
  Top Layer w0.254: U9.49 55.57,41.98 R67.1
JTDI: length 1.6
  Top Layer w0.254: U9.50 55.07,43.26 55.25,43.44
JTDO: length 2.2
  Top Layer w0.254: U9.55 52.58,41.89 52.58,42.98 53.29,43.69 R64.1
JTMS_SWDIO: length 4.4
  Top Layer w0.254: R68.1 59.06,40.82 59.57,40.3 59.57,39.03 59.42,38.87 U9.46
MODEM_RX: length 14.8
  Top Layer w0.254: R53.2 45.21,44.89 46.86,46.54 46.86,47.17 47.24,47.55 51.3,47.55 54.07,44.79 U9.52
MODEM_TX: length 14.2
  Top Layer w0.254: R52.2 50.15,49.2 54.57,44.79 U9.51
NRST: length 36.9
  Top Layer w0.254: U9.7 44.86,36.87 C52.2 44,37.73 44,37.93 43.94,37.99 43.94,38.28 42.42,39.81 42.42,41.84 v1(39.24,45.01) ; NRST1.2 NRST1.1 37.69,54.32 39.24,52.76 v1(39.24,50.86) 39.37,50.73 R62.1
  Bottom Layer w0.254: v1(39.24,45.01) v1(39.24,50.86)
PWM1: length 54.7
  Top Layer w0.254: U9.14 47.02,33.37 47.49,33.84 v1(48.39,33.84) ; v1(20.7,8.46) 20.26,8.46 19.8,8
  Bottom Layer w0.254: v1(20.7,8.46) 22.71,10.47 46.99,10.47 48.39,11.87 v1(48.39,33.84)
PWM2: length 59.6
  Top Layer w0.254: v1(14.1,8.13) 15.12,8.13 U2.9 ; v1(47.75,33.08) 47.55,32.87 U9.15
  Bottom Layer w0.254: v1(47.75,33.08) 47.75,32.57 47.98,32.34 47.98,12.1 46.99,11.1 22.22,11.1 19.25,8.13 v1(14.1,8.13)
RGB_MOSI: length 3
  Top Layer w0.254: U9.36 v1(56.47,33.87)
  Bottom Layer w0.254: R21.1 57.02,34.43 v1(56.47,33.87)
RGB_SCK: length 4.4
  Top Layer w0.254: v1(56.13,32.82) 57.51,32.82 U9.34
  Bottom Layer w0.254: v1(56.13,32.82) 56.13,33.5 55.75,33.88 R22.1
SENS1: length 60.7
  Top Layer w0.254: U2.15 19.15,7.07 v1(20.07,6.15) ; U9.29 54.07,26.25 v1(54.48,25.84)
  Bottom Layer w0.254: v1(54.48,25.84) 54.48,6.71 53.92,6.15 45.67,6.15 45.64,6.18 32.08,6.18 32.06,6.15 v1(20.07,6.15)
SENS2: length 64.7
  Top Layer w0.254: v1(53.59,24.95) 53.57,24.98 U9.28 ; v1(15.11,6.79) 15.4,7.07 15.44,7.07 15.9,7.53 U2.10
  Bottom Layer w0.254: v1(53.59,24.95) 53.59,7.17 53.34,6.91 45.92,6.91 45.64,6.63 44.78,6.63 44.5,6.91 43.38,6.91 43.1,6.63 42.24,6.63 41.96,6.91 40.84,6.91 40.56,6.63 39.7,6.63 39.42,6.91 38.3,6.91 38.02,6.63 37.16,6.63 36.88,6.91 35.76,6.91 35.48,6.63 34.62,6.63 34.46,6.8 33.55,6.8 33.39,6.63 31.63,6.63 31.36,6.91 15.24,6.91 v1(15.11,6.79)
SERVO1: length 28.2
  Top Layer w0.254: R25.1 v1(32.51,12.25) ; U9.16 v1(46.07,31.68)
  Bottom Layer w0.254: v1(32.51,12.25) 34.04,12.25 44.32,22.53 44.32,29.94 v1(46.07,31.68)
SERVO2: length 26.7
  Top Layer w0.254: U9.17 v1(47.12,30.37) ; R26.1 v1(35.05,12.25)
  Bottom Layer w0.254: v1(35.05,12.25) 36.58,12.25 47.24,22.92 47.24,27.52 47.12,27.64 v1(47.12,30.37)
SERVO3: length 42.1
  Top Layer w0.254: R27.1 37.59,11.87 38.61,12.88 55.5,12.88 v1(55.63,13.01) ; v1(55.58,33.34) 57.53,33.34 U9.35
  Bottom Layer w0.254: v1(55.58,33.34) 55.58,13.05 v1(55.63,13.01)
SERVO4: length 43.7
  Top Layer w0.254: v1(58.8,15.17) 56.13,12.5 41.99,12.5 R28.1 ; U9.42 57.58,36.89 v1(58.93,36.89)
  Bottom Layer w0.254: v1(58.93,36.89) 58.8,36.76 v1(58.8,15.17)
SERVO5: length 43.4
  Top Layer w0.254: R29.1 44.17,12.15 56.79,12.15 58.42,13.77 v1(58.46,13.77) ; v1(59.47,37.61) 59.21,37.87 U9.44
  Bottom Layer w0.254: v1(59.47,37.61) 59.47,14.79 v1(58.46,13.77)
SERVO6: length 28.2
  Top Layer w0.254: R30.1 v1(45.21,11.64) ; U9.10 v1(47.62,35.37)
  Bottom Layer w0.254: v1(47.62,35.37) 46.57,34.32 46.57,31.64 47.62,30.58 47.62,14.06 v1(45.21,11.64)
TOF1_SCL: length 25
  Top Layer w0.254: U9.61 49.57,40.92 50.03,40.46 v1(50.15,40.46)
  Bottom Layer w0.254: v1(50.15,40.46) 47.37,43.24 38.35,43.24 36.84,44.75 30.99,44.75 30.82,44.59 30.82,44.51 R9.1 30.52,44.12 arc(30.45,43.75) 30.24,43.44 arc(30.14,43.29) 30.1,43.11 U18.C4
TOF1_SDA: length 27.3
  Top Layer w0.254: U9.59 50.57,40.75 50.75,40.57 v1(50.75,40.31)
  Bottom Layer w0.254: U18.C3 29.35,43.89 arc(29.32,44.04) R8.1 30.35,45.27 37.34,45.27 38.74,43.87 47.5,43.87 47.67,43.7 47.67,43.64 48.18,43.14 48.24,43.14 50.75,40.62 v1(50.75,40.31)
TOF2_SCL: length 19.8
  Top Layer w0.254: 58.85,18.27 59.57,18.99 59.57,35.35 58.55,36.37 U9.41
TOF2_SDA: length 17.5
  Top Layer w0.254: U9.40 58.52,35.87 58.85,35.54 R45.1
USART1_RX: length 3.9
  Top Layer w0.254: v1(54.61,37.52) 54.76,37.37 U9.43
  Bottom Layer w0.254: R60.2 54.53,37.6 v1(54.61,37.52)
USART1_TX: length 2.6
  Top Layer w0.254: R61.1 50.8,43.49 51.05,43.24 51.05,41.89 U9.58
$1N3928: length 1.2
  Top Layer w0.254: U2.11 16.55,7.35 16.35,7.15 16.35,6.96 C35.2
$1N4156: length 1.5
  Top Layer w0.254: U2.14 18.57,7.93 C34.2
$1N4345: length 13.3
  Top Layer w0.5: U25.2 7.14,15.53 7.83,14.83 15.41,14.83 15.9,14.34 U2.7
$1N4374: length 12.9
  Top Layer w0.5: U2.2 19.15,14.34 19.56,14.75 19.69,14.75 19.72,14.79 26.42,14.79 28.15,16.53 U24.6
$1N5186: length 1.4
  Top Layer w0.254: 3.54,13.14 3.56,13.15 R7.1
$1N5206: length 12.4
  Top Layer w0.254: LED3.1 5.12,13.7 U2.8
$1N5359: length 2.8
  Top Layer w0.5: U16.2 18.5,14.67 U2.3
$1N5410: length 2.8
  Top Layer w0.5: U17.2 16.55,14.67 U2.6
$1N10486: length 10.9
  Top Layer w0.5: U24.2 24.15,17.86 23.62,17.33 18.29,17.33 17.85,16.89 U2.4
$1N11048: length 3.3
  Top Layer w0.254: 19.8,13.7 21.74,13.7 R11.1 21.79,12.39 C63.2
$1N12603: length 13.3
  Top Layer w0.254: R74.1 11.8,18.23 U25.6
  Top Layer w0.5: 17.2,13.7 17.15,13.75 17.15,16.94 16.64,17.45 13.45,17.45 12,18.9 U25.6
$1N13824: length 3
  Top Layer w0.5: R73.2 24.45,15.74 22.48,15.74
$1N13826: length 1.8
  Top Layer w0.254: 8.7,16.31 9.08,15.93 R74.2
$2N361: length 19.1
  Top Layer w0.254: C2.1 54.74,29.25 54.64,29.35 54.64,30.3 U9.30 v1(54.57,31.81) ; v1(49.07,40.37) 49.07,41.87 U9.62 49.07,44.25 48.72,44.6 48.39,44.6
  Bottom Layer w0.5: v1(54.57,31.81) 54.57,33.86 54.59,33.89 54.59,35.13 49.35,40.37 v1(49.07,40.37)
$2N8197: length 36
  Top Layer w0.254: R32.2 v1(26.03,32.19) ; v1(51.05,32.44) 51.05,30.39 U9.23
  Bottom Layer w0.254: v1(51.05,32.44) 51.05,36 47.9,39.15 39.85,39.15 32.9,32.19 v1(26.03,32.19)
$2N8237: length 32.9
  Top Layer w0.254: v1(50.55,31.81) 50.55,30.39 U9.22 ; R33.2 27.69,31.04 v1(28.96,31.04)
  Bottom Layer w0.254: v1(50.55,31.81) 50.55,36 47.75,38.79 40.39,38.79 32.64,31.04 v1(28.96,31.04)
$2N8396: length 54.4
  Top Layer w0.254: R35.1 10.84,32.99 v1(24.73,32.99) ; v1(53.85,34.88) 53.85,34.87 U9.38
  Bottom Layer w0.254: v1(53.85,34.88) 48.87,39.86 38.41,39.86 31.62,33.08 24.81,33.08 v1(24.73,32.99)
$2N8439: length 52
  Top Layer w0.254: U9.37 57.56,34.38 54.2,34.38 v1(53.97,34.15) ; R36.1 12.71,32.31 v1(24.76,32.31)
  Bottom Layer w0.254: v1(24.76,32.31) 25.15,32.69 32.38,32.69 39.19,39.5 48.18,39.5 53.54,34.15 v1(53.97,34.15)
$3N248: length 1.2
  Top Layer w0.254: 35.4,38.87 34.2,38.87 arc(34.19,38.87) U10.8
$3N507: length 5.8
  Top Layer w0.254: U10.7 33.53,38.42 v1(33.4,38.28)
  Bottom Layer w0.254: LED1.1 30.61,35.49 v1(33.4,38.28)
$3N645: length 1.2
  Bottom Layer w0.254: R1.1 28.29,34.37 LED1.2
$3N740: length 3.6
  Top Layer w0.254: R3.1 33.71,37.5 R2.2 32.89,37.78 32.71,37.95 32.71,38.41 32.74,38.44 32.74,38.73 U10.6
$3N1481: length 1.2
  Top Layer w0.254: C28.2 26.06,6.14 arc(26.07,6.14) U11.8
$3N1484: length 1.3
  Top Layer w0.254: U11.7 26.73,6.69 26.66,6.75 26.66,6.89 26.29,7.26
$3N1485: length 1.5
  Top Layer w0.254: 26.29,8.34 26.29,8.49 R4.1
$3N1486: length 2.2
  Top Layer w0.254: R5.2 R6.1 27.23,6.5 arc(27.23,6.48) 27.23,6.46 27.23,6.43 arc(27.28,6.27) U11.6
$3N5305: length 13.8
  Top Layer w2: BAT3.1 12.87,54.69 arc(12.98,54.71) 13.08,54.78
  Bottom Layer w1: BAT3.1 7.24,54.69 2.67,50.11 D7.2
$4N413: length 1.6
  Bottom Layer w0.254: R13.1 31.34,39.47 arc(30.98,40.02) U18.A5
$4N484: length 2.1
  Bottom Layer w0.254: R12.2 27.55,39.94 arc(27.77,40.27) U18.A1
$4N541: length 2.1
  Bottom Layer w0.254: R10.1 29.08,40.02 arc(29.28,40.32) U18.A3
$4N833: length 2.2
  Bottom Layer w0.254: R14.1 27.82,43.5 arc(27.88,43.46) 27.95,43.44 28.21,43.44 28.39,43.26 arc(28.55,43.03) U18.C2
$4N4166: length 1.8
  Top Layer w0.254: 57.99,18.14 57.91,18.22 tof5.3
$4N4209: length 1.9
  Top Layer w0.254: tof5.2 57.73,19.23 R45.2
$5N411: length 4
  Bottom Layer w0.254: LED5.1 16.74,58.23 16.74,58.07 16.57,57.9 14.61,57.9 14.45,58.07 14.45,58.25 LED4.3
$5N415: length 3.2
  Bottom Layer w0.254: LED5.6 LED4.4
$5N420: length 3.2
  Bottom Layer w0.254: LED5.3 LED6.1
$5N425: length 3.2
  Bottom Layer w0.254: LED5.4 LED6.6
$5N430: length 4.5
  Bottom Layer w0.254: LED7.1 26.33,58.24 26.33,57.81 26.16,57.65 24.2,57.65 24.04,57.81 24.04,58.24 LED6.3
$5N439: length 3.2
  Bottom Layer w0.254: LED7.6 LED6.4
$5N768: length 3.2
  Bottom Layer w0.254: LED7.4 LED8.6
$5N772: length 3.2
  Bottom Layer w0.254: LED9.6 LED8.4
$5N777: length 3.2
  Bottom Layer w0.254: LED9.4 LED10.6
$5N782: length 3.2
  Bottom Layer w0.254: LED7.3 LED8.1
$5N787: length 4
  Bottom Layer w0.254: LED9.1 35.81,58.14 35.81,58.07 35.65,57.9 33.69,57.9 33.53,58.07 33.53,58.33 LED8.3
$5N792: length 3.2
  Bottom Layer w0.254: LED9.3 LED10.1
$5N797: length 4.3
  Bottom Layer w0.254: LED11.1 45.47,58.22 45.47,57.94 45.3,57.78 43.34,57.78 43.18,57.94 43.18,58.26 LED10.3
$5N801: length 3.2
  Bottom Layer w0.254: LED11.6 LED10.4
$5N1333: length 31
  Bottom Layer w0.254: R21.2 57.02,38.16 58.97,40.1 58.97,52.72 52.96,58.73 47.58,58.73 LED11.3
$5N1382: length 28.8
  Bottom Layer w0.254: LED11.4 47.62,57.08 51.69,57.08 58.42,50.35 58.42,41.23 55.69,38.49 55.69,38.07 55.75,38.01 R22.2
$6N595: length 4
  Top Layer w0.254: SERVO2.1 32.51,10.04
  Bottom Layer w0.254: D13.2 32.46,7.73 SERVO2.1
$6N638: length 4
  Top Layer w0.254: SERVO2.2 35.05,10.04
  Bottom Layer w0.254: SERVO2.2 35.05,9.25 D12.2
$6N681: length 4
  Top Layer w0.254: 37.59,10.04 SERVO2.3
  Bottom Layer w0.254: SERVO2.3 37.59,9.21 D11.2
$6N724: length 4
  Top Layer w0.254: SERVO2.4 40.13,10.04
  Bottom Layer w0.254: D10.2 40.13,9.14 SERVO2.4
$6N810: length 4.1
  Top Layer w0.254: 45.21,10.04 SERVO2.6
  Bottom Layer w0.254: SERVO2.6 45.21,8.81 45.15,8.87 45.15,9.07 D8.2
$6N855: length 4
  Top Layer w0.254: 42.67,10.04 SERVO2.5
  Bottom Layer w0.254: D9.2 42.67,9.07 SERVO2.5
$7N449: length 32.2
  Top Layer w0.254: 24.08,45.96 24.26,45.78 42.43,45.78 R53.1 ; 24.08,45.96 24.08,51.04 H1.1 ; 24.08,45.96 23.96,45.84 18.7,45.84 U7.5
$7N1405: length 32.8
  Top Layer w0.254: U7.4 15.08,47.65 16.76,49.33 19.18,49.33 H1.2 22.61,52.76 26.54,52.76 30.1,49.2 R52.1
$8N1824: length 11.1
  Top Layer w0.254: 50.8,45.19 v1(50.8,46.28) ; v1(44.45,51.62) 44.32,51.75 H2.14
  Bottom Layer w0.254: v1(50.8,46.28) 49.78,46.28 v1(44.45,51.62)
$8N1829: length 2.3
  Top Layer w0.254: 45.59,53.02 45.59,50.8 R62.2
$8N1835: length 13.3
  Top Layer w0.254: R63.2 55.12,44.74 50.27,49.59 48.26,49.59 46.86,50.98 H2.10
$8N1841: length 10.6
  Top Layer w0.254: v1(48.13,51.49) H2.8 ; v1(52.71,45.39) 52.71,45.19 R64.2
  Bottom Layer w0.254: v1(52.71,45.39) 48.13,49.97 v1(48.13,51.49)
$8N1846: length 12
  Top Layer w0.254: H2.6 49.4,51.84 56.77,44.48 R67.2
$8N1852: length 14.5
  Top Layer w0.254: H2.4 50.67,52 58.97,43.7 58.97,42.9 59.06,42.82 R68.2
$8N2131: length 27.8
  Top Layer w0.254: v1(41.66,51.87) 41.66,57.08 42.67,58.09 H2.13
  Bottom Layer w0.254: R60.1 53.41,38.46 48.38,43.49 48.33,43.49 48.03,43.79 48.03,43.85 46.04,45.84 44.55,45.84 44.38,46 44.38,47.62 41.66,50.35 v1(41.66,51.87)
$9N336: length 2.5
  Top Layer w0.254: R46.2 39.52,18.65 ADC24.2
$9N337: length 3.6
  Top Layer w0.254: R49.2 43.87,18.72 42.93,18.72 42.52,18.32 ADC24.5
$9N338: length 1.7
  Top Layer w0.254: adc6.2 50.28,19.23 50.55,19.49 R50.2
$9N339: length 1.7
  Top Layer w0.254: R51.2 49.51,18.09 adc6.3
$9N340: length 2.2
  Top Layer w0.254: ADC24.3 40.64,17.54 R47.2
$9N341: length 2.6
  Top Layer w0.254: ADC24.4 41.52,18.41 R48.2

## Copper pours and planes (outline as drawn; the poured copper is in the pictures)
GND on Top Layer: 0,60 60,60 60,0 0,0
GND on Bottom Layer: 0,60 60,60 60,0 0,0

## Text on the board
Top Silkscreen Layer: 17V Max | 1A continuous | Antenne | USB
